# Altium schematic sheet ESP32-WROOM-32.SchDoc
size 393 x 281 mm; SheetNumber: 5; SheetTotal: 6
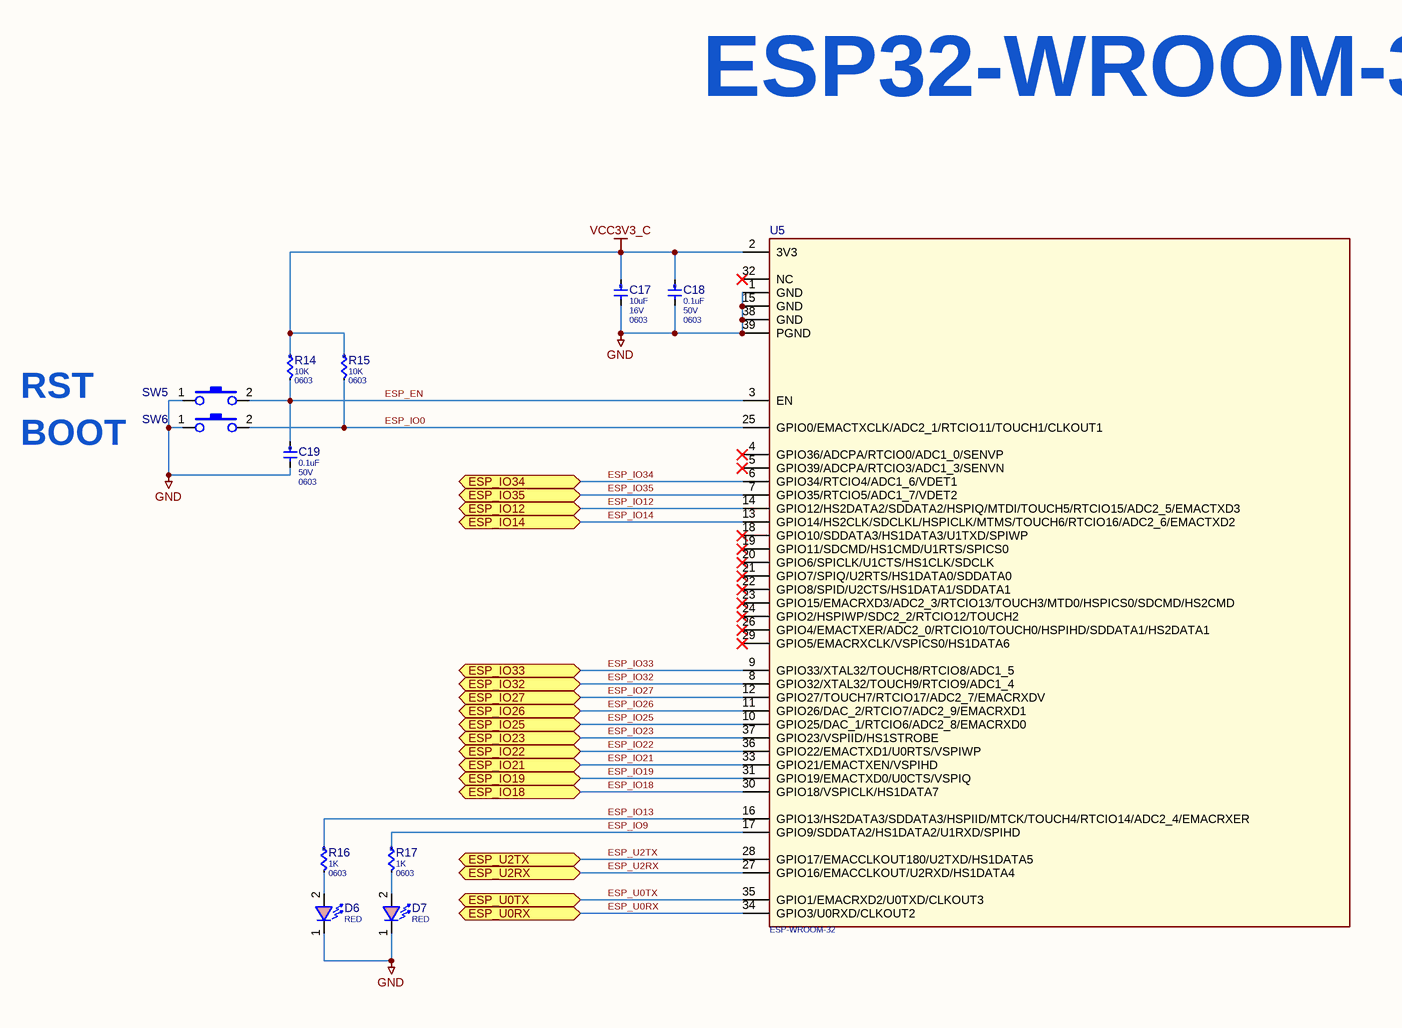
[diagram p0: ESP32-WROOM-32.SchDoc]

## Parts
C17  value 10uF  VOLTAGE: 16V  PACK: 0603  [C0603]  (hidden comment: 10uF 16V 0603)
C18  value 0.1uF  VOLTAGE: 50V  PACK: 0603  [C0603]  (hidden comment: 0.1uF 50V 0603)
C19  value 0.1uF  VOLTAGE: 50V  PACK: 0603  [C0603]  (hidden comment: 0.1uF 50V 0603)
D6  COLOR: RED  [LED0805_RED]  (hidden comment: LH R974-LP-1)
D7  COLOR: RED  [LED0805_RED]  (hidden comment: LH R974-LP-1)
R14  value 10K  PACK: 0603  [R0603]  (hidden comment: 10K 0603)
R15  value 10K  PACK: 0603  [R0603]  (hidden comment: 10K 0603)
R16  value 1K  PACK: 0603  [R0603]  (hidden comment: 1K 0603)
R17  value 1K  PACK: 0603  [R0603]  (hidden comment: 1K 0603)
SW5  BTN 3x6x5 SMD  [BTN_6L3W5H]  (value not drawn)
SW6  BTN 3x6x5 SMD  [BTN_6L3W5H]  (value not drawn)
U5  ESP-WROOM-32  [ESP-WROOM-32]

## Ports
ESP_IO12 (bidir), ESP_IO14 (bidir), ESP_IO18 (bidir), ESP_IO19 (bidir), ESP_IO21 (bidir), ESP_IO22 (bidir), ESP_IO23 (bidir), ESP_IO25 (bidir), ESP_IO26 (bidir), ESP_IO27 (bidir), ESP_IO32 (bidir), ESP_IO33 (bidir), ESP_IO34 (bidir), ESP_IO35 (bidir), ESP_U0RX (bidir), ESP_U0TX (bidir), ESP_U2RX (bidir), ESP_U2TX (bidir)

## Nets
GND: C17.2 C18.2 C19.2 D6.1(K) D7.1(K) SW5.1(1,2) SW6.1(1,2) U5.1(GND) U5.15(GND) U5.38(GND) U5.39(PGND)
VCC3V3_C: C17.1 C18.1 R14.1 R15.1 U5.2(3V3)
ESP_EN: C19.1 R14.2 SW5.2(3,4) U5.3(EN)
ESP_IO0: R15.2 SW6.2(3,4) U5.25(GPIO0/EMACTXCLK/ADC2_1/RTCIO11/TOUCH1/CLKOUT1)
ESP_IO9: R17.1 U5.17(GPIO9/SDDATA2/HS1DATA2/U1RXD/SPIHD)
ESP_IO12: U5.14(GPIO12/HS2DATA2/SDDATA2/HSPIQ/MTDI/TOUCH5/RTCIO15/ADC2_5/EMACTXD3) ; port ESP_IO12
ESP_IO13: R16.1 U5.16(GPIO13/HS2DATA3/SDDATA3/HSPIID/MTCK/TOUCH4/RTCIO14/ADC2_4/EMACRXER)
ESP_IO14: U5.13(GPIO14/HS2CLK/SDCLKL/HSPICLK/MTMS/TOUCH6/RTCIO16/ADC2_6/EMACTXD2) ; port ESP_IO14
ESP_IO18: U5.30(GPIO18/VSPICLK/HS1DATA7) ; port ESP_IO18
ESP_IO19: U5.31(GPIO19/EMACTXD0/U0CTS/VSPIQ) ; port ESP_IO19
ESP_IO21: U5.33(GPIO21/EMACTXEN/VSPIHD) ; port ESP_IO21
ESP_IO22: U5.36(GPIO22/EMACTXD1/U0RTS/VSPIWP) ; port ESP_IO22
ESP_IO23: U5.37(GPIO23/VSPIID/HS1STROBE) ; port ESP_IO23
ESP_IO25: U5.10(GPIO25/DAC_1/RTCIO6/ADC2_8/EMACRXD0) ; port ESP_IO25
ESP_IO26: U5.11(GPIO26/DAC_2/RTCIO7/ADC2_9/EMACRXD1) ; port ESP_IO26
ESP_IO27: U5.12(GPIO27/TOUCH7/RTCIO17/ADC2_7/EMACRXDV) ; port ESP_IO27
ESP_IO32: U5.8(GPIO32/XTAL32/TOUCH9/RTCIO9/ADC1_4) ; port ESP_IO32
ESP_IO33: U5.9(GPIO33/XTAL32/TOUCH8/RTCIO8/ADC1_5) ; port ESP_IO33
ESP_IO34: U5.6(GPIO34/RTCIO4/ADC1_6/VDET1) ; port ESP_IO34
ESP_IO35: U5.7(GPIO35/RTCIO5/ADC1_7/VDET2) ; port ESP_IO35
ESP_U0RX: U5.34(GPIO3/U0RXD/CLKOUT2) ; port ESP_U0RX
ESP_U0TX: U5.35(GPIO1/EMACRXD2/U0TXD/CLKOUT3) ; port ESP_U0TX
ESP_U2RX: U5.27(GPIO16/EMACCLKOUT/U2RXD/HS1DATA4) ; port ESP_U2RX
ESP_U2TX: U5.28(GPIO17/EMACCLKOUT180/U2TXD/HS1DATA5) ; port ESP_U2TX
NetD6_2: D6.2(A) R16.2
NetD7_2: D7.2(A) R17.2

Not connected (* = marked no-connect by the designer): U5 4(GPIO36/ADCPA/RTCIO0/ADC1_0/SENVP)* 5(GPIO39/ADCPA/RTCIO3/ADC1_3/SENVN)* 18(GPIO10/SDDATA3/HS1DATA3/U1TXD/SPIWP)* 19(GPIO11/SDCMD/HS1CMD/U1RTS/SPICS0)* 20(GPIO6/SPICLK/U1CTS/HS1CLK/SDCLK)* 21(GPIO7/SPIQ/U2RTS/HS1DATA0/SDDATA0)* 22(GPIO8/SPID/U2CTS/HS1DATA1/SDDATA1)* 23(GPIO15/EMACRXD3/ADC2_3/RTCIO13/TOUCH3/MTD0/HSPICS0/SDCMD/HS2CMD)* 24(GPIO2/HSPIWP/SDC2_2/RTCIO12/TOUCH2)* 26(GPIO4/EMACTXER/ADC2_0/RTCIO10/TOUCH0/HSPIHD/SDDATA1/HS2DATA1)* 29(GPIO5/EMACRXCLK/VSPICS0/HS1DATA6)* 32(NC)*

## Notes on the sheet
- ESP32-WROOM-32
- RST
- BOOT
- Title:
- Size:
- A3
- Date Modified:
- Document Number:
- Rev:
- Engineer:
- Sheet
- Of

## Library data of the parts
C17 = C0603_10uF_16V_10%: CAP CER 10UF 10% 16V X5R 0603 SMD; MGR: Murata Electronics; MGR PN: GRM188R61C106KAALJ; Group: CAP CER; Line Type: SMT; Unit: PCS; TYPE: CAP; Mounting Type: SMD; PHX PN: *; PHX CODE: *; NOTE: *; SAP code: *; Part Code: *; Part Type: EP; TEMP: X5R; TOLERANCE: 10%
C18 C19 = C0603_0.1uF_50V_10%: CAP CER 0.1UF 10% 50V X7R 0603 SMD; MGR: Murata Electronics; MGR PN: GCM188R71H104KA57D; Group: CAP CER; Line Type: SMT; Unit: PCS; TYPE: CAP; Mounting Type: SMD; PHX PN: *; PHX CODE: *; NOTE: *; SAP code: *; Part Code: *; Part Type: EP; TEMP: X7R; TOLERANCE: 10%
D6 D7 = LED0805_RED: LED IND RED 1.8V 20mA 0805 SMD; MGR: OSRAM; Group: LED IND; Line Type: SMT; Unit: PCS; PACK: 0805; TYPE: LED; Mounting Type: SMD; PHX PN: *; PHX CODE: *; NOTE: *; SAP code: *; Part Code: *; Part Type: EP; VF(V): 1.8V; IF(mA): 20mA; MGR PN: LH R974-LP-1
R14 R15 = R0603_10K_1/10W_1%: RES CHP 10K 1% 1/10W 0603 SMD; MGR: PANASONIC; MGR PN: ERJ-3EKF1002V; Group: RES CHP; Line Type: SMT; Unit: PCS; TYPE: RES; Mounting Type: SMD; PHX PN: *; PHX CODE: *; NOTE: *; SAP code: *; Part Code: *; Part Type: EP; POWER: 1/10W; TOLERANCE: 1%
R16 R17 = R0603_1K_1/10W_1%: RES CHP 1K 1% 1/10W 0603 SMD; MGR: PANASONIC; MGR PN: ERJ-3EKF1001V; Group: RES CHP; Line Type: SMT; Unit: PCS; TYPE: RES; Mounting Type: SMD; PHX PN: *; PHX CODE: *; NOTE: *; SAP code: *; Part Code: *; Part Type: EP; POWER: 1/10W; TOLERANCE: 1%
SW5 SW6 = SWT_BTN_3x6x5: SWT BTN 3x6x5 SMD; MGR: BANLINHKIEN; Group: SWT BTN; Line Type: SMT; PACK: 6L3W5H; Unit: PCS; TYPE: SWT; Mounting Type: SMD; PHX PN: *; PHX CODE: *; NOTE: *; SAP code: *; Part Code: *; Part Type: EP; MGR PN: BTN 3x6x5 SMD
U5 = MDL_ESP-WROOM-32: MDL TRX ESP-WROOM-32  SMD; MGR: Espressif Systems; Group: MDL TRX; Line Type: SMT; Unit: PCS; VOLTAGE: 3V ~ 3.6V; TYPE: MDL; Mounting Type: SMD; PHX PN: *; PHX CODE: *; NOTE: *; SAP code: *; Part Code: *; Part Type: EP; CURRENT: *; MGR PN: ESP-WROOM-32